# EAGLE schematic BREAKOUT_GUVC (EAGLE 9.5.2)
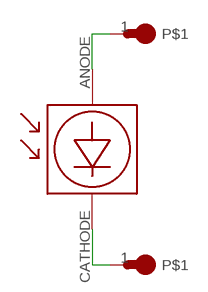
[diagram p0: schematic, sheet 1]

## Parts
1  JP0  [JP0]
2  JP0  [JP0]
U$1  GUVC-S10GD  [GUVD-S10GD]

## Nets
N$1: 1.1 U$1.ANODE
N$2: 2.1 U$1.CATHODE

## Library data of the parts
1 2 = jumper-4:JP0
U$1 = GUVC-S10GD:GUVC-S10GD